# EAGLE design 腕駆動回路 (EAGLE 9.6.2)
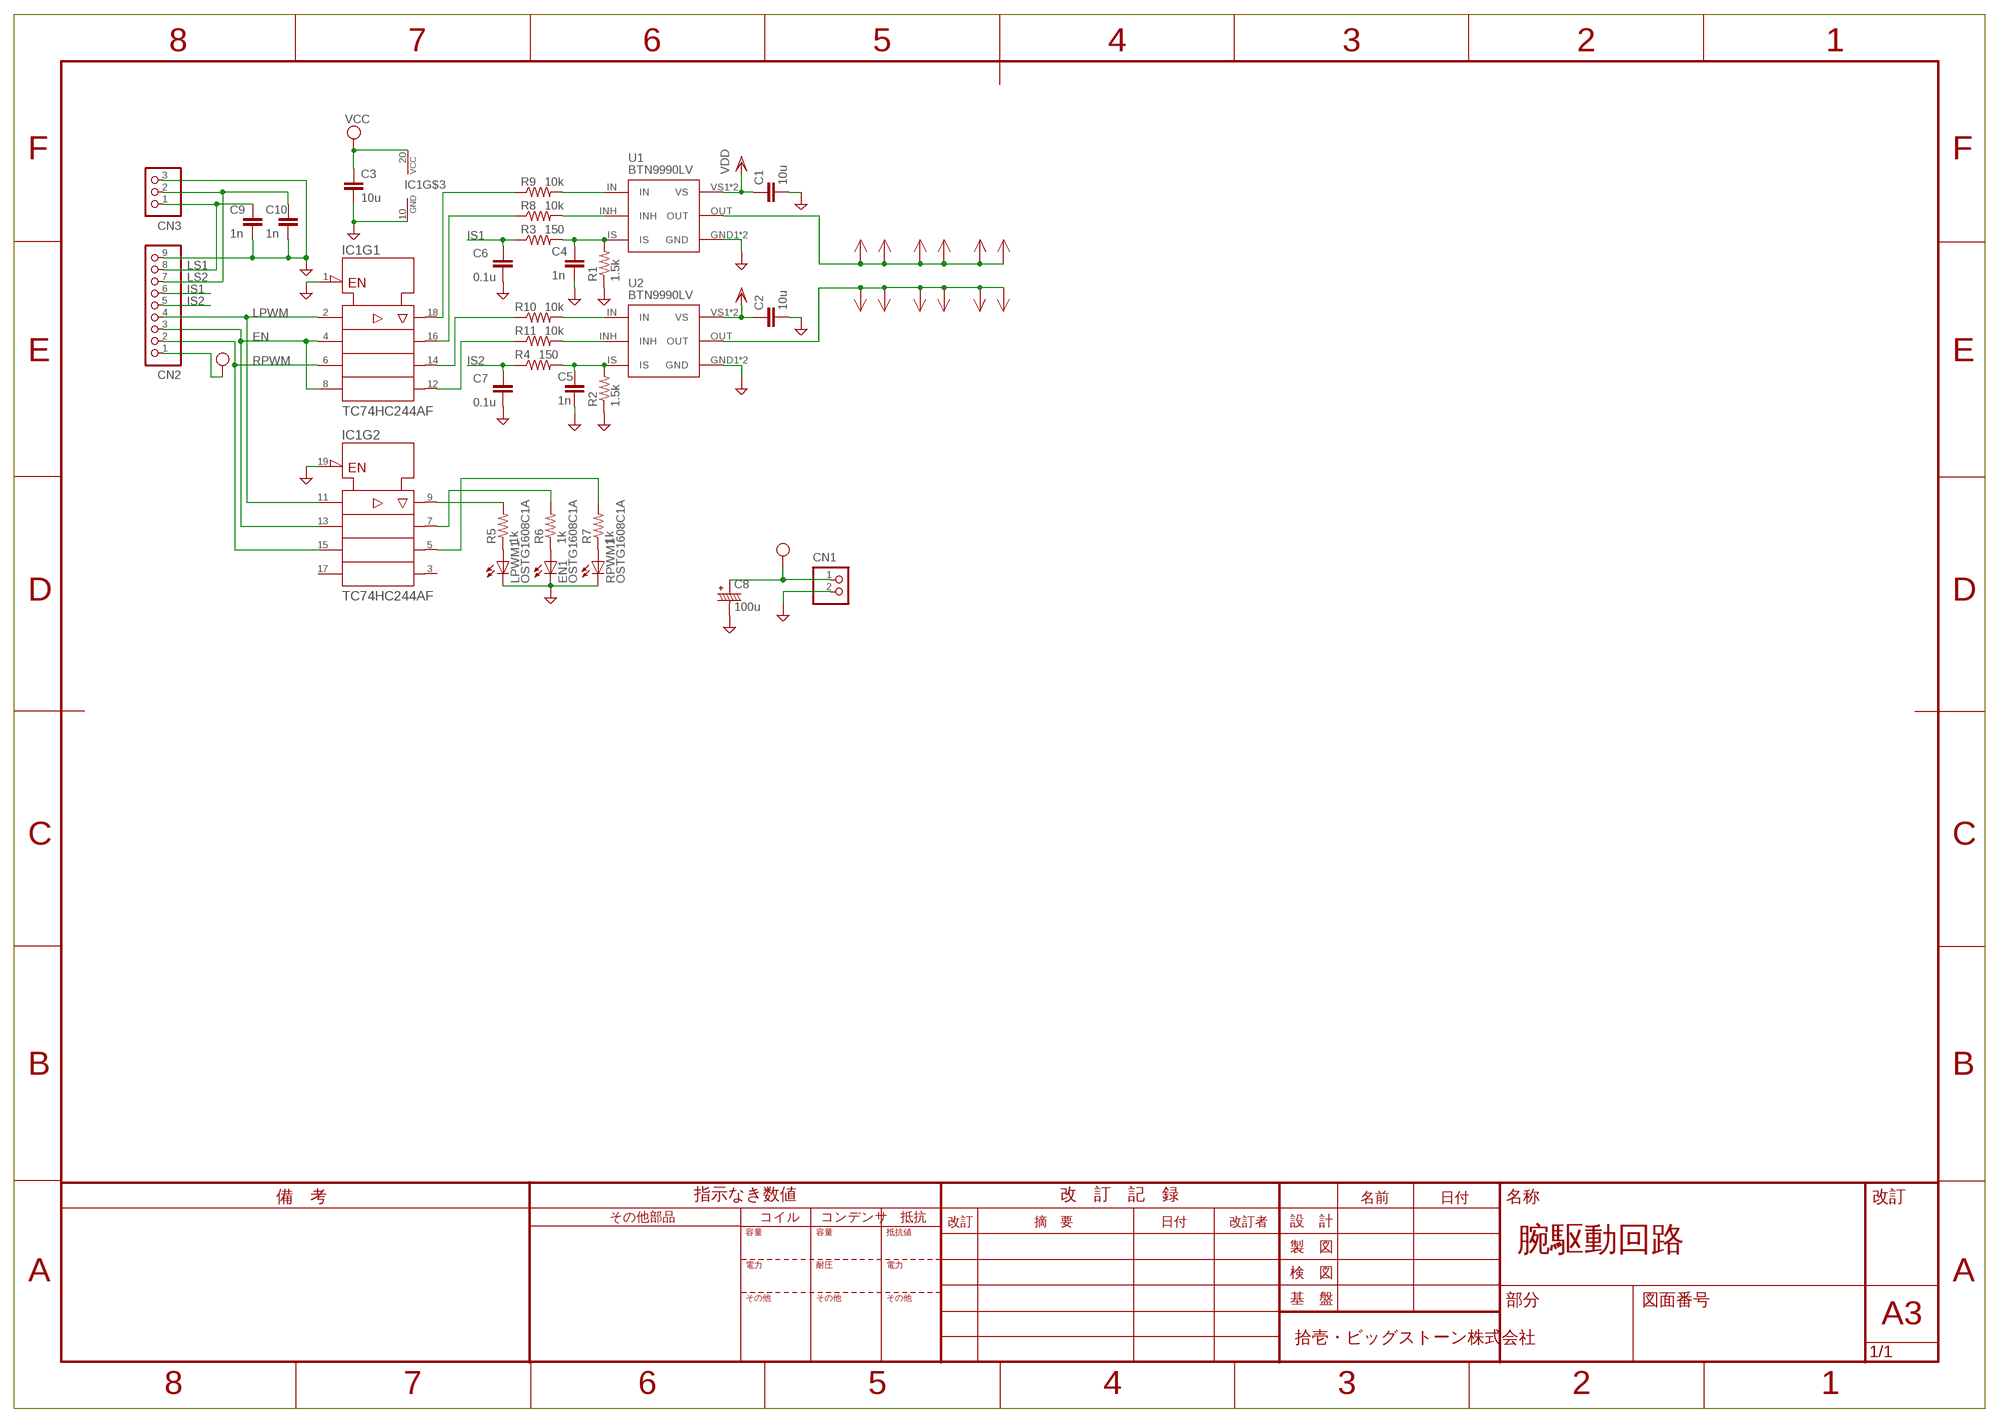
[diagram p0: schematic, sheet 1]

## Parts
C1  10u  GCM31CD71H106KE36K  [C3216]
C2  10u  GCM31CD71H106KE36K  [C3216]
C3  10u  GCM31CD71H106KE36K  [C3216]
C4  1n  GCM188R91H102KA37D  [C1608]
C5  1n  GCM188R91H102KA37D  [C1608]
C6  0.1u  GCM188L81H104KA57D  [C1608]
C7  0.1u  GCM188L81H104KA57D  [C1608]
C8  100u  16MH7100MEFC6.3X7  [CPOL6.3-7_2.5]
C9  1n  GCM188R91H102KA37D  [C1608]
C10  1n  GCM188R91H102KA37D  [C1608]
CN1  B2B-XH-A  [B2B-XH-A]
CN2  B9B-XH-A  [B9B-XH-A]
CN3  B3B-XH-A  [B3B-XH-A]
EN1  OSTG1608C1A  [LEDC1608X39N_G]
IC1  TC74HC244AF  [SOP20]
LPWM1  OSTG1608C1A  [LEDC1608X39N_G]
OUT1  VIA_2.5X5.25_D0.75  [VIA_2X5.25_D0.75]
R1  1.5k  R1608  [R0603]
R2  1.5k  R1608  [R0603]
R3  150  R1608  [R0603]
R4  150  R1608  [R0603]
R5  1k  R1608  [R0603]
R6  1k  R1608  [R0603]
R7  1k  R1608  [R0603]
R8  10k  RC0603J10K  [R1608]
R9  10k  RC0603J10K  [R1608]
R10  10k  RC0603J10K  [R1608]
R11  10k  RC0603J10K  [R1608]
RPWM1  OSTG1608C1A  [LEDC1608X39N_G]
U1  BTN9990LV  [BTN9990LV]
U2  BTN9990LV  [BTN9990LV]
U$2  VIA_2.5X5.25_D0.75  [VIA_2X5.25_D0.75]
U$4  VIA_2.5X5.25_D0.75  [VIA_2X5.25_D0.75]
U$5  VIA_2.5X5.25_D0.75  [VIA_2X5.25_D0.75]
U$6  VIA_2.5X5.25_D0.75  [VIA_2X5.25_D0.75]
U$7  VIA_2.5X5.25_D0.75  [VIA_2X5.25_D0.75]
U$8  VIA_2.5X5.25_D0.75  [VIA_2X5.25_D0.75]
U$9  VIA_2.5X5.25_D0.75  [VIA_2X5.25_D0.75]
U$10  VIA_2.5X5.25_D0.75  [VIA_2X5.25_D0.75]
U$11  VIA_2.5X5.25_D0.75  [VIA_2X5.25_D0.75]
U$12  VIA_2.5X5.25_D0.75  [VIA_2X5.25_D0.75]
U$13  VIA_2.5X5.25_D0.75  [VIA_2X5.25_D0.75]

## Nets
EN: CN2.3 IC1.4(A2) IC1.8(A4) IC1.13(A2)
GND: C1.2 C2.2 C3.2 C4.2 C5.2 C6.2 C7.2 C8.- C9.2 C10.2 CN1.2 CN2.9 CN3.3 EN1.K(C) IC1.1(!G) IC1.10(GND) IC1.19(!G) LPWM1.K(C) R1.1 R2.1 RPWM1.K(C) U1.GND1(GND) U1.GND2(GND) U2.GND1(GND) U2.GND2(GND)
IS1: C6.1 CN2.6 R3.1
IS1_A: C4.1 R1.2 R3.2 U1.IS
IS2: C7.1 CN2.5 R4.1
IS2_1: C5.1 R2.2 R4.2 U2.IS
LPWM: CN2.4 IC1.2(A1) IC1.11(A1)
LS1: C9.1 CN2.8 CN3.1
LS2: C10.1 CN2.7 CN3.2
N$1: IC1.18(Y1) R9.1
N$2: IC1.16(Y2) R8.1
N$3: IC1.14(Y3) R10.1
N$4: IC1.12(Y4) R11.1
N$5: LPWM1.A R5.1
N$6: EN1.A R6.1
N$7: R7.1 RPWM1.A
N$8: IC1.9(Y1) R5.2
N$9: IC1.7(Y2) R6.2
N$10: IC1.5(Y3) R7.2
N$11: R8.2 U1.INH
N$12: R9.2 U1.IN
N$13: R10.2 U2.IN
N$14: R11.2 U2.INH
OUT1 [power]: OUT1.P$1 U1.OUT U$2.P$1 U$4.P$1 U$5.P$1 U$6.P$1 U$7.P$1
OUT2 [power]: U2.OUT U$8.P$1 U$9.P$1 U$10.P$1 U$11.P$1 U$12.P$1 U$13.P$1
RPWM: CN2.2 IC1.6(A3) IC1.15(A3)
VCC: C3.1 C8.+ CN1.1 CN2.1 IC1.20(VCC)
VDD: C1.1 C2.1 U1.VS1(VS) U1.VS2(VS) U2.VS1(VS) U2.VS2(VS)
Unconnected: IC1.3(Y4) IC1.17(A4)

## Library data of the parts
C1-C3 = 村田製作所_チップセラミックコンデンサ:GCM?*: 一般用チップ積層セラミックコンデンサ GCMシリーズ; 01_CLASS: チップセラミックコンデンサ; 02_BENDER: DigiKey; 03_MAKER: ㈱村田製作所; 04_CHARA: 50V X7T ±10%; 05_COST: 245222; 06_QTY: 6000; 10_DIGIKEY_CODE: 490-GCM31CD71H106KE36KDKR-ND
C4 C5 C9 C10 = 村田製作所_チップセラミックコンデンサ:GCM?*: 一般用チップ積層セラミックコンデンサ GCMシリーズ; 01_CLASS: チップセラミックコンデンサ; 02_BENDER: DigiKey; 03_MAKER: ㈱村田製作所; 04_CHARA: 50V X8R ±10%; 05_COST: 13782; 06_QTY: 4000; 10_DIGIKEY_CODE: 490-14360-2-ND
C6 C7 = 村田製作所_チップセラミックコンデンサ:GCM?*: 一般用チップ積層セラミックコンデンサ GCMシリーズ; 01_CLASS: チップセラミックコンデンサ; 02_BENDER: DigiKey; 03_MAKER: ㈱村田製作所; 04_CHARA: 50V X8L ±10%; 05_COST: 14655; 06_QTY: 4000; 10_DIGIKEY_CODE: 490-6049-6-ND
C8 = 小形アルミニウム電解コンデンサ_MH7シリーズ:16MH7100MEFC6.3X7
CN1 = jst-xh:B2B-XH-A: Wire-to-Board 2.5mm pitch top mount connector Source: http://www.jst-mfg.com/product/pdf/jpn/XH.pdf http://www.jst-mfg.com/product/detail.php?series=277
CN2 = jst-xh:B9B-XH-A: Wire-to-Board 2.5mm pitch top mount connector Source: http://www.jst-mfg.com/product/pdf/jpn/XH.pdf http://www.jst-mfg.com/product/detail.php?series=277
CN3 = jst-xh:B3B-XH-A: Wire-to-Board 2.5mm pitch top mount connector Source: http://www.jst-mfg.com/product/pdf/jpn/XH.pdf http://www.jst-mfg.com/product/detail.php?series=277
EN1 LPWM1 RPWM1 = LED:OSTG1608C1A: 緑色チップＬＥＤ ［１６０８］ ＯＳＴＧ１６０８Ｃ１Ａ （２０個入） [OSTG1608C1A] 通販コード I-06417 発売日 2013/03/26 ・標準電流：5mA ◆絶対最大定格(Ta=25℃) ・VR：5V ・PD：100mW ◆電気光学特性(IF=5mA、Ta=25℃、Typ.) ・VF：2.9V ・IV：103mcd D：525nm ・2θ1/2：120° ■カラーバリエーション 白色I-03986 </catalog/g/gI-03986/> 赤色I-03978 </catalog/g/gI-03978/> 緑色I-06417 </catalog/g/gI-06417/> 青色I-03982 </catalog/g/gI-03982/> 黄色I-03984 </catalog/g/gI-03984/> 橙色I-06416 </catalog/g/gI-06416/> 黄緑色I-03980 </catalog/g/gI-03980/> ウォームホワイト色I-09640 </catalog/g/gI-09640> [I-06417] 緑色チップＬＥＤ ［１６０８］ ＯＳＴＧ１６０８Ｃ１Ａ （２０個入） 1パック ￥250（税込）
IC1 = 東芝_74LSシリーズ:TC74HC244
OUT1 U$2 U$4-U$13 = ビア・パッド:VIA_2.5X5.25_D0.75
R1-R7 = RCL:R: RESISTOR, American symbol; SPICEPREFIX: R
R8-R11 = FLE_抵抗器:RC0603J: チップ抵抗 RCシリーズ 1608サイズ; 01_CLASS: チップ抵抗; 02_BENDER: 秋月電子通商; 03_MAKER: FAITHFUL LINK INDUSTRIAL CORP.; 04_CHARA: 1/10W ±5%; 05_COST: 980; 06_QTY: 5000; 10_AKIZUKI_CODE: R-15029
U1 U2 = IT_MotorControlIC:BTN9990LV

## Net classes
1 power: clearance 0.508 mm

## Board
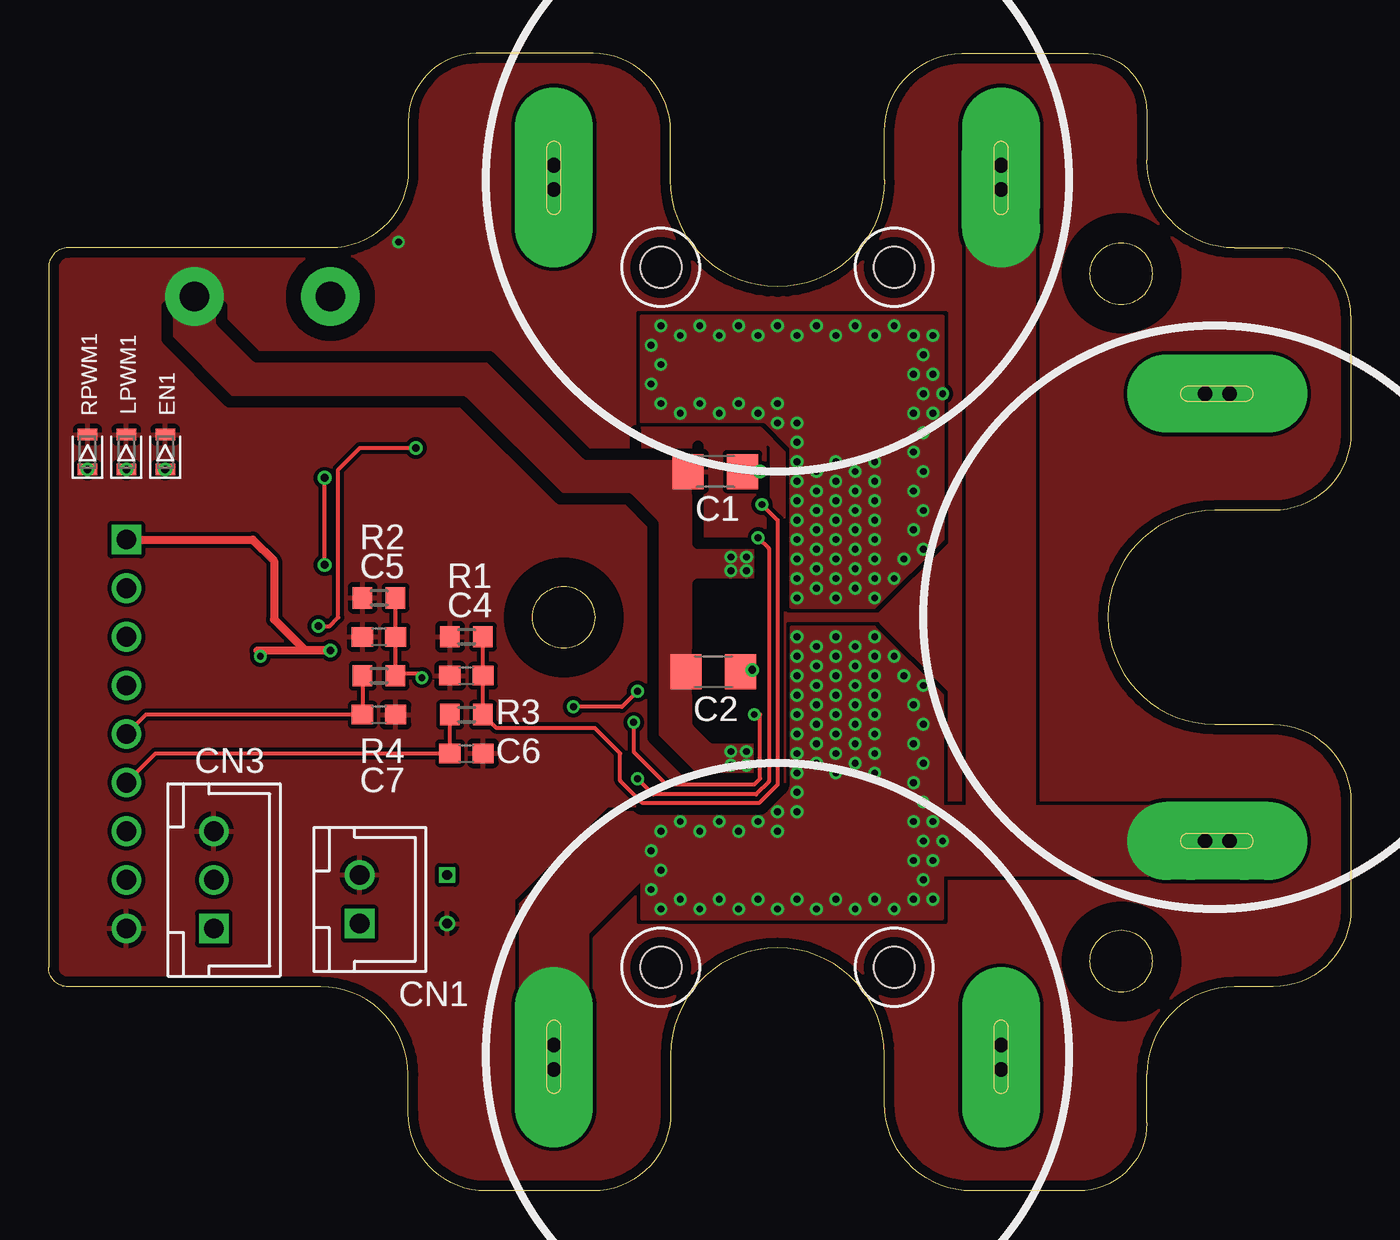
[diagram p1: board, top side]
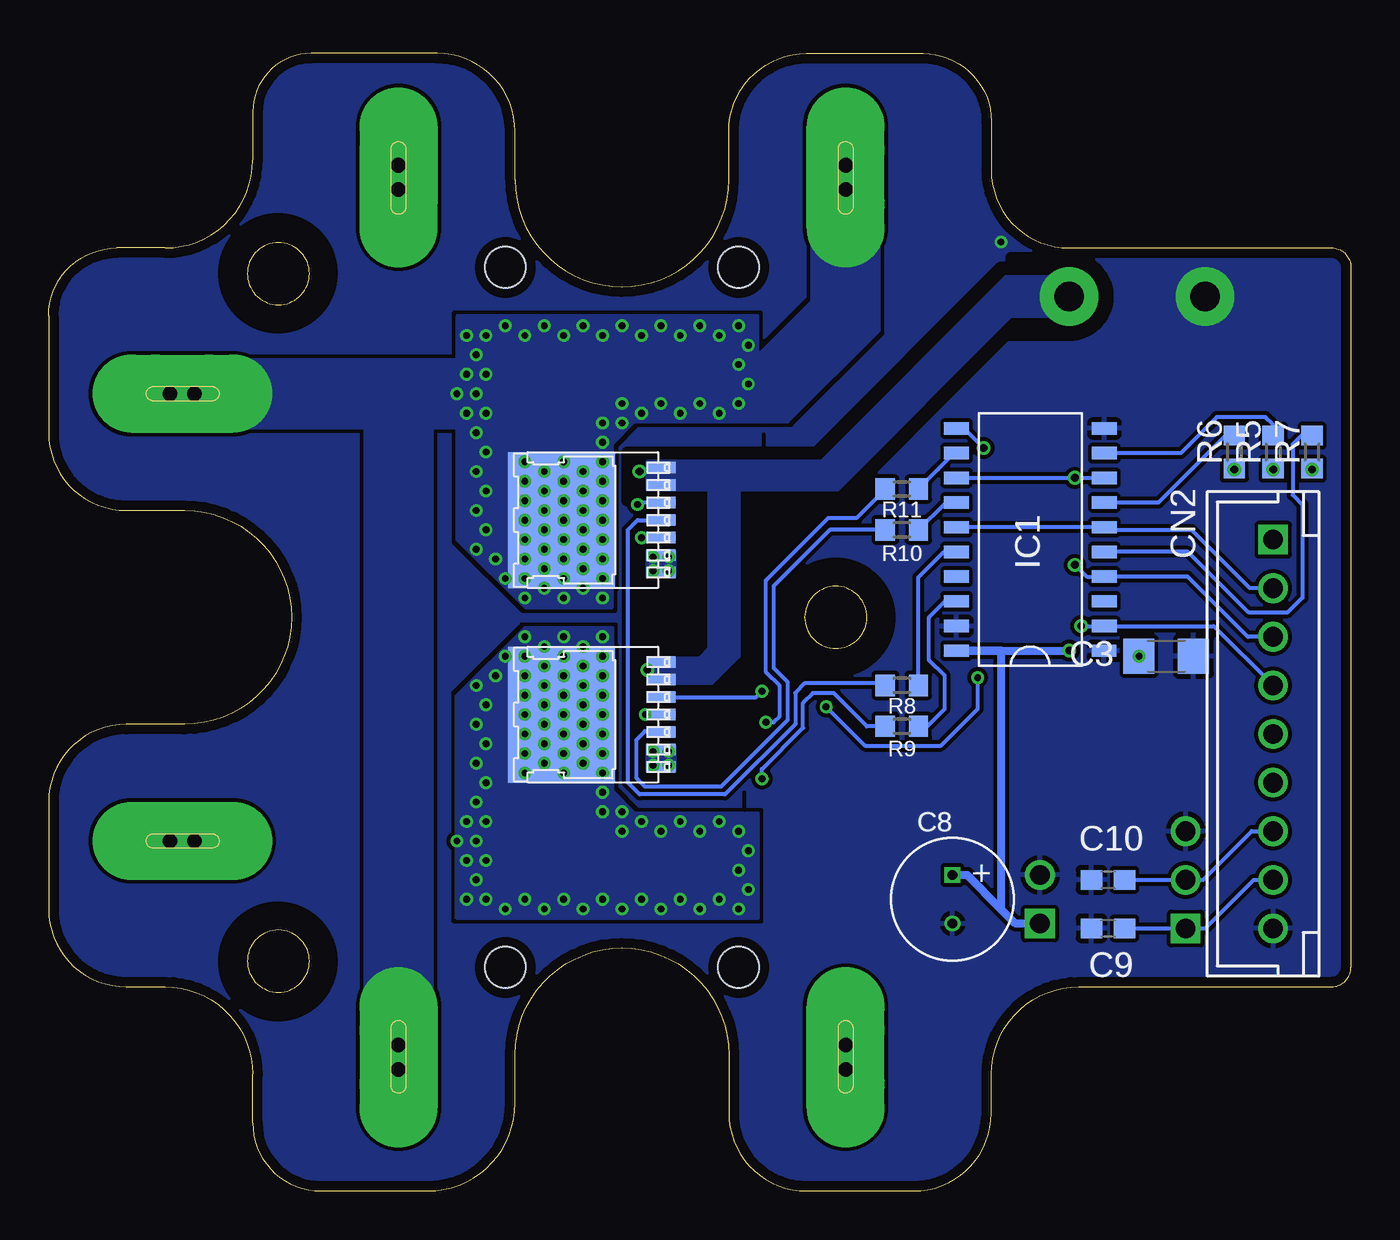
[diagram p2: board, bottom side, seen from below]

Size 67 x 58.5 mm. Coordinates in mm from the lower left corner, seen from the top.
Outline: 56.78,47.18 arc-90 55.18,45.58 arc-90 53.58,47.18 arc-90 55.18,48.78 arc-90 56.78,47.18
Outline: 28.1,29.5 arc-90 26.5,27.9 arc-90 24.9,29.5 arc-90 26.5,31.1 arc-90 28.1,29.5
Outline: 56.78,11.82 arc-90 55.18,10.22 arc-90 53.58,11.82 arc-90 55.18,13.42 arc-90 56.78,11.82
Outline: 48.62,50.6 arc180 49.38,50.6 49.38,53.6 arc180 48.62,53.6 48.62,50.6
Outline: 58.6,40.62 61.6,40.62 arc180 61.6,41.38 58.6,41.38 arc180 58.6,40.62
Outline: 25.62,50.6 arc90 26,50.23 arc90 26.38,50.6 26.38,53.6 arc90 26,53.98 arc90 25.62,53.6 25.62,50.6
Outline: 58.6,17.62 61.6,17.62 arc180 61.6,18.38 58.6,18.38 arc180 58.6,17.62
Outline: 48.62,5.4 arc180 49.38,5.4 49.38,8.4 arc180 48.62,8.4 48.62,5.4
Outline: 25.62,5.4 arc90 26,5.02 arc90 26.38,5.4 26.38,8.4 arc180 25.62,8.4 25.62,5.4
Outline: 0,47.5 0,11.5 arc90 1,10.5 14,10.5 arc-90 18.5,6 18.5,4 arc90 22.5,0 28,0 arc90 32,4 32,7 arc-90 37.5,12.5 arc-90 43,7 43,4.5 arc90 47.5,0 53,0 arc90 56.5,3.5 56.5,6 arc-90 61,10.5 63,10.5 arc90 67,14.5 67,20 arc90 63,24 60,24 arc-90 54.5,29.5 arc-90 60,35 63,35 arc90 67,39 67,45 arc90 63.5,48.5 61,48.5 arc-90 56.5,53 56.5,55.5 arc90 53.5,58.5 47,58.5 arc90 43,54.5 43,52 arc-90 37.5,46.5 arc-90 32,52 32,54.5 arc90 28,58.5 22,58.5 arc90 18.5,55 18.5,52.5 arc-90 14.5,48.5 1,48.5 arc90 0,47.5
Copper layers (1*16): Top 0.035mm / dielectric 1.6mm / Bottom 0.035mm
Design rules "Elecrow_2-layer_PCB_eagle_rule": minimum track width 8mil, minimum drill 12mil, track to track 8mil, track to pad 8mil, pad to pad 8mil, via to via 8mil, smd to smd 0mil, copper to edge 20mil, drill to drill 10mil, minimum pad ring 6mil, minimum via ring 6mil, stop-mask expansion 0mil, vias tented up to drill 100mil, thermal gap 10mil
Holes 2.1 mm at 31.5,47.5 43.5,47.5 31.5,11.5 43.5,11.5
tRestrict: area 23.5,26.5 to 29.5,32.5; area 52.2,44.2 to 58.2,50.2; area 52.2,8.8 to 58.2,14.8; 29 lines
bRestrict: area 23.5,26.5 to 29.5,32.5; area 52.2,44.2 to 58.2,50.2; area 52.2,8.8 to 58.2,14.8; 36 lines

### Footprints (pad centres in the part's own frame; a part is rotated, then mirrored left to right if it is on the bottom)
C3216 = smd 1.6 x 1.8: 1 -1.4,0; 2 1.4,0
C1608 = smd 1.1 x 1: 1 -0.85,0; 2 0.85,0
CPOL6.3-7_2.5 = drill 0.5 square: + -1.25,0 | drill 0.5: - 1.25,0
B2B-XH-A = drill 1.016 square: 1 -1.25,0 | drill 1.016: 2 1.25,0
B9B-XH-A = drill 1.016 square: 1 -10,0 | drill 1.016: 2 -7.5,0; 3 -5,0; 4 -2.5,0; 5 0,0; 6 2.5,0; 7 5,0; 8 7.5,0; 9 10,0
B3B-XH-A = drill 1.016 square: 1 -2.5,0 | drill 1.016: 2 0,0; 3 2.5,0
LEDC1608X39N_G = smd 0.6 x 1: A -0.9,0; K 0.9,0
SOP20 = smd 0.635 x 1.27: 1 -5.715,-3.8; 2 -4.445,-3.82; 3 -3.175,-3.82; 4 -1.905,-3.82; 5 -0.635,-3.82; 6 0.635,-3.82; 7 1.905,-3.82; 8 3.175,-3.82; 9 4.445,-3.82; 10 5.715,-3.82; 11 5.715,3.8; 12 4.445,3.8; 13 3.175,3.8; 14 1.905,3.8; 15 0.635,3.8; 16 -0.635,3.8; 17 -1.905,3.8; 18 -3.175,3.8; 19 -4.445,3.8; 20 -5.715,3.8
VIA_2X5.25_D0.75 = drill 0.75 pad 4 long: P$1 0,0
R0603 = smd 1 x 1.1: 1 -0.85,0; 2 0.85,0
R1608 = smd 1 x 1.1: 1 -0.85,0; 2 0.85,0
BTN9990LV = smd 0.6 x 1.5: GND1 -2.7,-3.5; GND2 -1.8,-3.5; IN -0.9,-3.5; INH 0,-3.5; IS 0.9,-3.5; VS1 1.8,-3.5; VS2 2.7,-3.5 | smd 7 x 5.5: OUT 0,1.6

### Placement (x,y rotation side)
C1  34.3,37 180 top
C2  34.2,26.7 180 top
C3  9.5,27.5 0 bottom
C4  21.5,26.5 180 top
C5  17,28.5 180 top
C6  21.5,22.5 0 top
C7  17,24.5 0 top
C8  20.5,15 270 bottom
C9  12.5,13.5 180 bottom
C10  12.5,16 180 bottom
CN1  16,15 90 top
CN2  4,23.5 270 bottom
CN3  8.5,16 90 top
EN1  6,38 90 top
IC1  16.5,33.5 90 bottom
LPWM1  4,38 90 top
OUT1  26,51.5 0 top
R1  21.5,28.5 0 top
R2  17,30.5 0 top
R3  21.5,24.5 0 top
R4  17,26.5 0 top
R5  4,38 90 bottom
R6  6,38 90 bottom
R7  2,38 90 bottom
R8  23.1,26 180 bottom
R9  23.1,23.9 180 bottom
R10  23.1,34 180 bottom
R11  23.1,36.1 180 bottom
RPWM1  2,38 90 top
U1  39,34.5 90 bottom
U2  39,24.5 90 bottom
U$2  26,52.75 0 top
U$4  59.5,41 90 top
U$5  60.75,41 90 top
U$6  49,7.5 180 top
U$7  49,6.25 180 top
U$8  59.5,18 90 top
U$9  26,6.25 0 top
U$10  26,7.5 0 top
U$11  49,51.5 0 top
U$12  60.75,18 90 top
U$13  49,52.75 180 top

### Tracks (layer width: path | path; a pad name or v marks a point on that pad's centre or on a via)
EN  (via drill 0.4)
  Top 0.203: v14.2,32.2 v14.2,36.67
  Bottom 0.203: IC1.13 IC1.8 v14.2,36.67 | CN2.3 5.3,28.5 8.39,31.59 IC1.4 13.6,31.59 v14.2,32.2
GND  (via drill 0.35, 1.5 pad 3)
  other vias: 7.5,46 35.9,32.6 35.1,32.6 35.1,22.6 35.9,22.6 35.1,31.9 35.9,31.9 35.1,21.9 35.9,21.9 18,48.8
  pour Top (rank 2): -3.5,-10.5 76.5,-10.5 76.5,69.5 -3.5,69.5
  pour Bottom (rank 2): 76.5,-10.5 -3.5,-10.5 -3.5,69.5 76.5,69.5
  pour Bottom (no thermals): 34.8,31.6 36.2,31.6 36.2,32.9 34.8,32.9
  pour Bottom (no thermals): 34.8,21.6 36.2,21.6 36.2,22.9 34.8,22.9
  pour Top (no thermals): 33.4,21.6 36.2,21.6 36.2,22.9 34,22.9 33,23.9 33,36.1 31.5,36.1 31.5,23.5
  pour Top (no thermals): 30,36 31.5,34.5 33,34.5 33,37.5 30,37.5
IS1
  Top 0.203: CN2.6 5.5,22.5 C6.1 R3.1
IS1_A  (via drill 0.35)
  Top 0.203: R1.2 C4.1 R3.2 23.05,23.8 28.1,23.8 29.4,22.5 29.4,21.1 30.56,19.94 36.54,19.94 37.5,20.9 37.5,34.5 v36.7,35.3
  Bottom 0.203: U1.IS 36.6,35.4 v36.7,35.3
IS2
  Top 0.203: R4.1 C7.1 5,24.5 CN2.5
IS2_1  (via drill 0.35)
  Top 0.203: R4.2 17.85,26.6 | 17.85,26.6 C5.1 R2.2 | v30.3,25.7 29.5,24.9 v27,24.9 | v19.2,26.4 19,26.6 17.85,26.6
  Bottom 0.203: U2.IS 30.6,25.4 v30.3,25.7 | v19.2,26.4 19.2,24.8 21.1,22.9 25,22.9 v27,24.9
LPWM  (via drill 0.4)
  Top 0.203: v13.88,29.05 14.46,29.05 14.9,29.5 14.9,37.1 16.02,38.22 v18.9,38.22
  Bottom 0.203: CN2.4 7.05,29.05 v13.88,29.05 IC1.2 | IC1.11 19.9,39.22 v18.9,38.22
LS1
  Bottom 0.203: C9.1 CN3.1 7.5,13.5 5,16 CN2.8
LS2
  Bottom 0.203: C10.1 CN3.2 7.6,16 5.1,18.5 CN2.7
N$1
  Bottom 0.203: R9.1 21.8,23.9 20.9,24.8 20.9,26.5 21.7,27.3 21.7,29.5 20.88,30.32 IC1.18
N$2
  Bottom 0.203: R8.1 22.25,31.55 20.93,32.87 IC1.16
N$3
  Bottom 0.203: R10.1 20.84,35.41 IC1.14
N$4
  Bottom 0.203: R11.1 21.24,37.11 21.24,37.12 20.41,37.95 IC1.12
N$5  (via drill 0.4)
  Bottom 0.203: R5.1 LPWM1.A
  other vias: 4,37.1
N$6  (via drill 0.4)
  Bottom 0.203: R6.1 EN1.A
  other vias: 6,37.1
N$7  (via drill 0.4)
  Bottom 0.203: R7.1 RPWM1.A
  other vias: 2,37.1
N$8
  Bottom 0.203: R5.2 4,39.4 4.4,39.8 6.9,39.8 8.75,37.95 IC1.9
N$9
  Bottom 0.203: R6.2 6.45,38.85 9.89,35.41 IC1.7
N$10
  Bottom 0.203: IC1.5 8.38,32.87 5.28,29.77 3.23,29.77 2.5,30.5 2.5,35.3 3,35.8 3,38.4 2.55,38.85 R7.2
N$11
  Bottom 0.203: R8.2 24.05,26.1 28.1,26.1 28.59,25.61 28.59,24.01 32.21,20.39 36.59,20.39 37.2,21 37.2,34 36.7,34.5 U1.INH
N$12  (via drill 0.35)
  Top 0.203: v36.5,33.6 37.05,33.05 37.05,21.05 36.4,20.4 31.1,20.4 v30.3,21.2
  Bottom 0.203: R9.2 24.9,23.9 26.6,25.6 27.68,25.6 28.18,25.1 28.18,23.82 30.3,21.7 v30.3,21.2 | U1.IN v36.5,33.6
N$13
  Bottom 0.203: R10.2 26.8,34 29.7,31.1 29.7,26.9 28.99,26.19 28.99,24.21 32.4,20.8 36.32,20.8 36.75,21.23 36.75,23.22 36.32,23.65 35.55,23.65 | 34.9,23.7 35.6,23.7 35.55,23.65 | U2.IN 35.55,23.65
N$14  (via drill 0.35)
  Top 0.203: v30.1,24.1 30.1,22.6 31.8,20.9 36.3,20.9 36.6,21.2 36.6,24.5 v36.3,24.5
  Bottom 0.203: R11.2 25.45,34.6 26.9,34.6 30.11,31.39 30.11,26.71 29.4,26 29.4,24.4 29.7,24.1 v30.1,24.1 | U2.INH v36.3,24.5
OUT1  (via drill 0.35)
  other vias: 38.5,30.5 40.5,30.5 42.5,30.5 41.5,31 39.5,31 38.5,31.5 40.5,31.5 42.5,31.5 41.5,32 39.5,32 38.5,32.5 40.5,32.5 42.5,32.5 41.5,33 39.5,33 38.5,33.5 40.5,33.5 42.5,33.5 41.5,34 39.5,34 38.5,34.5 40.5,34.5 42.5,34.5 41.5,35 39.5,35 38.5,35.5 40.5,35.5 42.5,35.5 41.5,36 39.5,36 38.5,36.5 40.5,36.5 42.5,36.5 41.5,37 39.5,37 38.5,37.5 40.5,37.5 42.5,37.5 38.5,38.5 38.5,39.5 37.5,39.5 37.5,40.5 36.5,40 35.5,40.5 34.5,40 33.5,40.5 32.5,40 31.5,40.5 31,41.5 31.5,42.5 31,43.5 31.5,44.5 32.5,44 33.5,44.5 34.5,44 35.5,44.5 36.5,44 37.5,44.5 38.5,44 39.5,44.5 40.5,44 41.5,44.5 42.5,44 43.5,44.5 44.5,44 45,43 44.5,42 45,41 44.5,40 45,39 44.5,38 45,37 44.5,36 45,35 44.5,34 45,33 44,32.5 43.5,31.5 45.5,42 45.5,40 46,41 45.5,44
  pour Bottom (no thermals): 24.25,53.75 arc-90 26,55.5 arc-90 27.75,53.75 27.75,45.75 30.75,42.75 38.75,42.75 43.25,38.25 43.25,31 38,31 38,38.4 36.85,39.55 28.95,39.55 24.25,44.25
  pour Bottom (no thermals): 38,31 38,38 42.75,42.75 61.75,42.75 arc-90 63.5,41 arc-90 61.75,39.25 44.5,39.25 43.25,38 43.25,31
  pour Bottom (no thermals): 50.75,5.45 arc-90 48.88,3.58 arc-90 47.25,5.2 47.25,41.75 47,42 50.75,42
  pour Bottom (no thermals): 38,30 38,38.4 36.85,39.55 30.5,39.55 30.5,45 46,45 46,33.5 42.5,30
  pour Top (no thermals): 38.2,30 38.2,38.2 36.85,39.55 30.5,39.55 30.5,45 46,45 46,33.5 42.5,30
OUT2  (via drill 0.35)
  other vias: 38.5,27.5 38.5,26.5 38.5,25.5 39.5,26 38.5,24.5 39.5,25 39.5,27 39.5,24 38.5,23.5 39.5,23 38.5,22.5 39.5,22 38.5,21.5 40.5,21.5 40.5,22.5 40.5,23.5 40.5,24.5 40.5,25.5 40.5,26.5 40.5,27.5 41.5,27 41.5,26 41.5,25 41.5,24 41.5,23 41.5,22 42.5,21.5 42.5,22.5 42.5,23.5 42.5,24.5 42.5,25.5 42.5,26.5 42.5,27.5 41.5,28 39.5,28 40.5,28.5 38.5,28.5 42.5,28.5 38.5,20.5 38.5,19.5 37.5,19.5 37.5,18.5 36.5,19 35.5,18.5 34.5,19 33.5,18.5 32.5,19 31.5,18.5 31,17.5 31.5,16.5 31,15.5 31.5,14.5 32.5,15 33.5,14.5 34.5,15 35.5,14.5 36.5,15 37.5,14.5 38.5,15 39.5,14.5 40.5,15 41.5,14.5 42.5,15 43.5,14.5 44.5,15 45,16 44.5,17 45,18 44.5,19 45,20 44.5,21 45,22 44.5,23 45,24 44.5,25 45,26 44,26.5 43.5,27.5 45.5,19 45.5,17 46,18 45.5,15
  pour Top (no thermals): 50.75,54.55 arc90 48.88,56.42 arc90 47.25,54.8 47.25,16.31 50.75,16.31
  pour Top (no thermals): 38.2,28 38.2,20.8 42.75,16.25 61.75,16.25 arc90 63.5,18 arc90 61.75,19.75 44.5,19.75 43.25,21 43.25,28
  pour Top (no thermals): 24.25,5.25 arc90 26,3.5 arc90 27.75,5.25 27.75,13.25 30.5,16 38.5,16 43.25,20.75 43.25,28 38.2,28 38.2,20.8 36.85,19.45 28.95,19.45 24.25,14.75
  pour Top: 38.2,29 38.2,20.8 36.85,19.45 30.5,19.45 30.5,14 46,14 46,25.5 42.5,29
  pour Bottom (no thermals): 38,29 38,20.6 36.85,19.45 30.5,19.45 30.5,14 46,14 46,25.5 42.5,29
RPWM
  Bottom 0.203: CN2.2 5.2,31 8.2,34 12.54,34 IC1.6 IC1.15
VCC  (via drill 0.35, 0.4)
  Top 0.406: CN2.1 10.5,33.5 11.6,32.4 11.6,29.4 13.2,27.8 v14.5,27.8 10.75,27.8 C3.1
  Bottom 0.406: 18,14.5 18,27.79 IC1.20 14.52,27.79 v14.5,27.8 | CN1.1 17.25,13.75 18,14.5 | C8.+ 19.75,16.25 18,14.5
  other vias: 10.9,27.5
VDD  (via drill 0.4, 1.5 pad 3)
  Top 0.203: C1.1 v36.6,37 | v36.2,26.8 36.1,26.7 C2.1
  Bottom 0.203: U1.VS2 C1.1 v36.6,37
  other vias: 14.5,46
  pour Bottom (no thermals): 27.25,37.5 36.2,37.5 36.2,36.1 26.4,36.1 17.5,45 14.5,45 arc-90 13.5,46 arc-90 14.5,47 17.75,47
  pour Bottom (no thermals): 32.9,26.1 36.2,26.1 36.2,27.4 33.5,27.4 33,27.9 33,36.5 31.5,36.5 31.5,27.5

### Text on the board
_bPlace: IC1 | C8
_tNames: RPWM1 | LPWM1 | EN1 | C1 | R2 | C5 | R1 | C4 | C2 | R3 | CN3 | R4 | C6 | C7 | CN1
_bNames: R7 | R5 | R6 | R11 | R10 | CN2 | C3 | R8 | R9 | C10 | C9